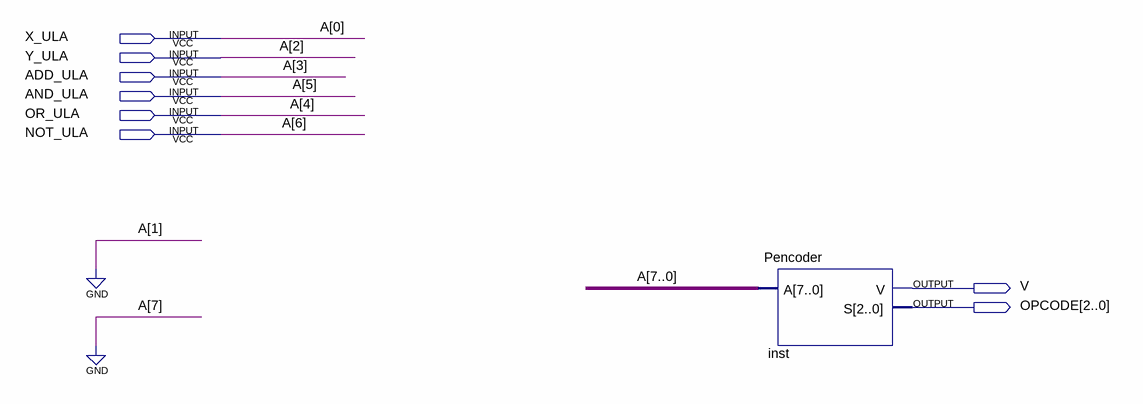
[diagram p0: schematic sheet]
// Quartus schematic ENCODER_ULA.bdf as structural Verilog: 1 symbols, 8 pins
module ENCODER_ULA (
  input  X_ULA,
  input  Y_ULA,
  input  ADD_ULA,
  input  AND_ULA,
  input  OR_ULA,
  input  NOT_ULA,
  output V,
  output [2:0] OPCODE
);

  Pencoder inst (.A({1'b0, NOT_ULA, AND_ULA, OR_ULA, ADD_ULA, Y_ULA, 1'b0, X_ULA}), .V(V), .S(OPCODE));

  // Other names for the same wires on the sheet: A (some bits) = {NOT_ULA, AND_ULA, OR_ULA, ADD_ULA, Y_ULA, X_ULA}
endmodule
